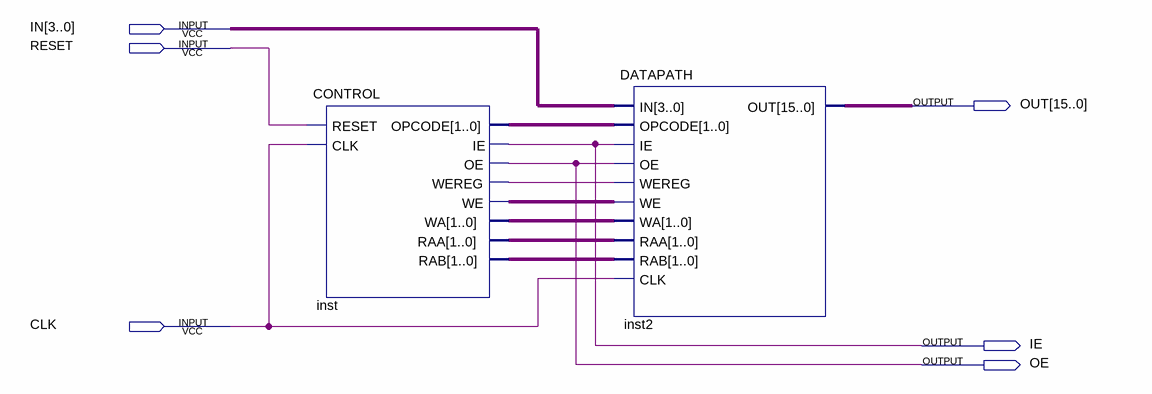
[diagram p0: schematic sheet]
// Quartus schematic PRCS.bdf as structural Verilog: 2 symbols, 6 pins
module PRCS (
  input  [3:0] IN,
  input  RESET,
  input  CLK,
  output [15:0] OUT,
  output IE,
  output OE
);

  wire inst_we, inst_wereg;
  wire [1:0] inst_opcode, inst_raa, inst_rab, inst_wa;

  CONTROL inst (
    .RESET(RESET), .CLK(CLK), .OPCODE(inst_opcode), .IE(IE), .OE(OE), .WEREG(inst_wereg), .WE(inst_we),
    .WA(inst_wa), .RAA(inst_raa), .RAB(inst_rab));
  DATAPATH inst2 (
    .IN(IN), .IE(IE), .WA(inst_wa), .WE(inst_we), .RAA(inst_raa), .RAB(inst_rab), .CLK(CLK),
    .OPCODE(inst_opcode), .OE(OE), .WEREG(inst_wereg), .OUT(OUT));
endmodule
